# Altium schematic sheet StreamDeck_CPU2-V0.SchDoc: Microcontrolador/UART - Stream Deck
size A4; Author: Guido Glorioso; Revision: 0; SheetNumber: 4; SheetTotal: 5
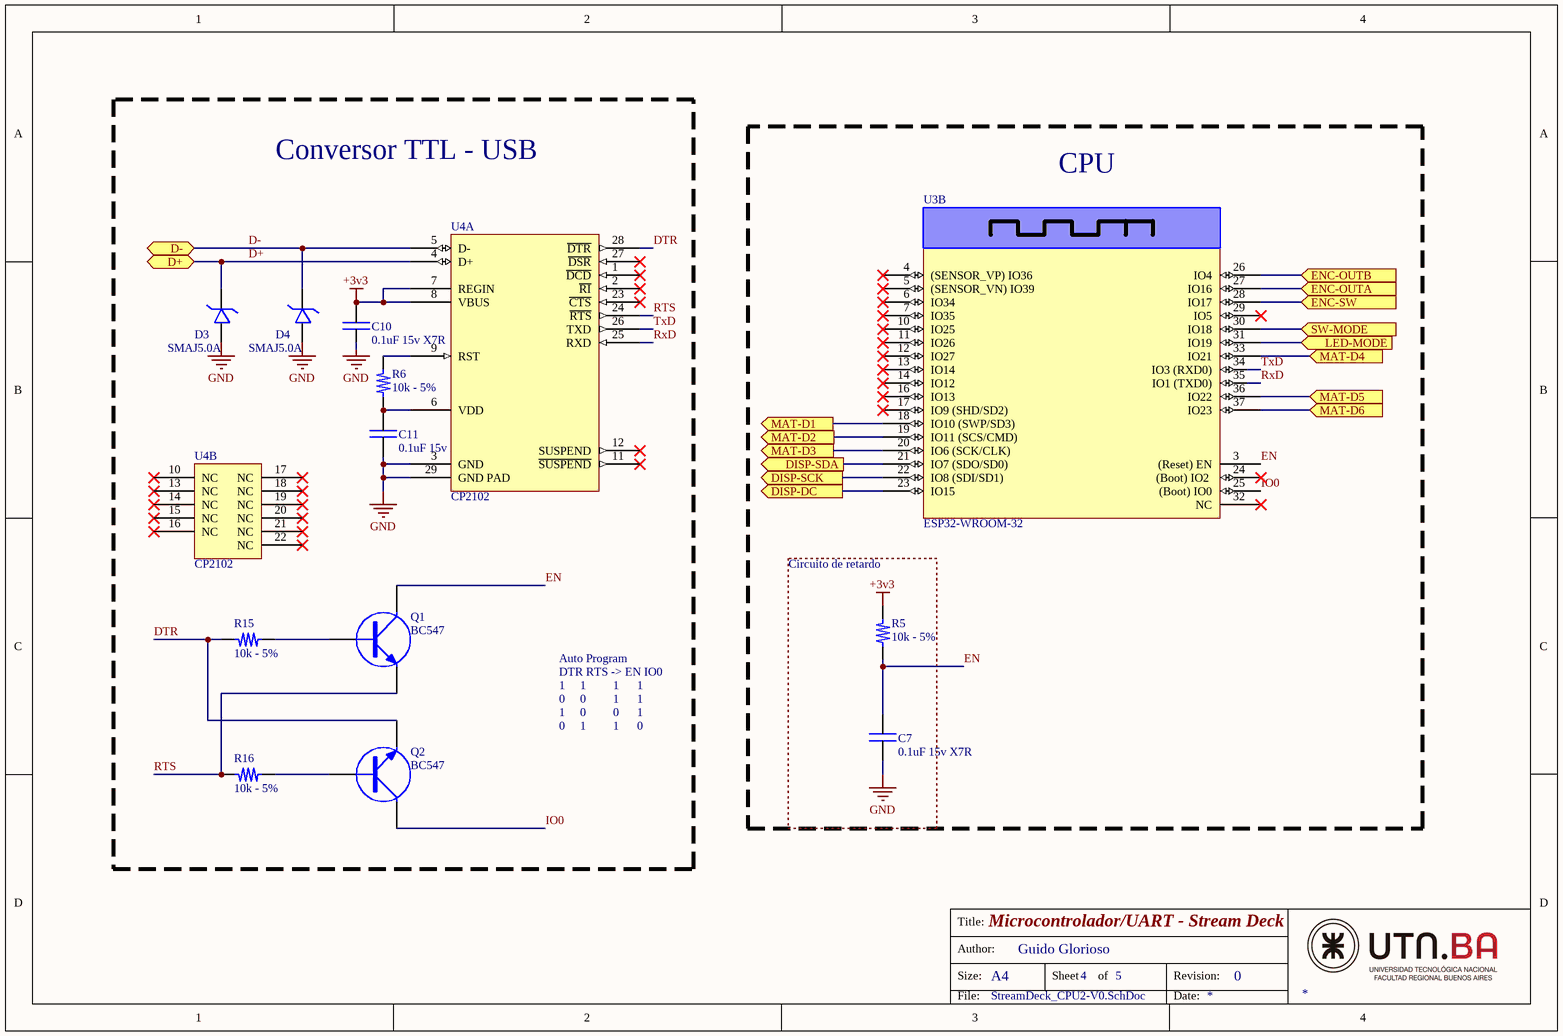
[diagram p0: StreamDeck_CPU2-V0.SchDoc]

## Parts
C7  0.1uF 15v X7R  [C_0805]
C10  0.1uF 15v X7R  [C_0805]
C11  0.1uF 15v X7R  [C_0805]
D3  SMAJ5.0A  [D_SMA]
D4  SMAJ5.0A  [D_SMA]
Q1  BC547  [SOT_23]
Q2  BC547  [SOT_23]
R5  10k - 5%  [R_0805]
R6  10k - 5%  [R_0805]
R15  10k - 5%  [R_0805]
R16  10k - 5%  [R_0805]
U3  ESP32-WROOM-32  [Espressif ESP32-WROOM-32]  (part B of 2)
U4  CP2102  [QFN-28N]  (parts A,B of 2)

## Blocks framed on the sheet
Conversor TTL - USB: C10 C11 D3 D4 Q1 Q2 R6 R15 R16 U4
CPU: U3
Circuito de retardo: C7 R5

## Ports
D+ (bidir, see StreamDeck_BLK-V0[2B], StreamDeck_alimentacion-V0[2C]), D- (bidir, see StreamDeck_BLK-V0[2B], StreamDeck_alimentacion-V0[2D]), DISP-DC (out, see StreamDeck_BLK-V0[2B], StreamDeck_Perifericos-V0[3C]), DISP-SCK (out, see StreamDeck_BLK-V0[2B], StreamDeck_Perifericos-V0[3C]), DISP-SDA (out, see StreamDeck_BLK-V0[2B], StreamDeck_Perifericos-V0[3C]), ENC-OUTA (in, see StreamDeck_BLK-V0[2B], StreamDeck_Perifericos-V0[3A]), ENC-OUTB (in, see StreamDeck_BLK-V0[2B], StreamDeck_Perifericos-V0[3A]), ENC-SW (in, see StreamDeck_BLK-V0[2C], StreamDeck_Perifericos-V0[4A]), LED-MODE (in, see StreamDeck_BLK-V0[2C], StreamDeck_Perifericos-V0[4C]), MAT-D1 (out, see StreamDeck_BLK-V0[2B], StreamDeck_Perifericos-V0[1A]), MAT-D2 (out, see StreamDeck_BLK-V0[2B], StreamDeck_Perifericos-V0[2A]), MAT-D3 (out, see StreamDeck_BLK-V0[2B], StreamDeck_Perifericos-V0[2A]), MAT-D4 (in, see StreamDeck_BLK-V0[2B], StreamDeck_Perifericos-V0[3A]), MAT-D5 (in, see StreamDeck_BLK-V0[2B], StreamDeck_Perifericos-V0[3B]), MAT-D6 (in, see StreamDeck_BLK-V0[2B], StreamDeck_Perifericos-V0[3B]), SW-MODE (in, see StreamDeck_BLK-V0[2C], StreamDeck_Perifericos-V0[4C])

## Nets
+3v3: C10.1 R5.2 U4.7(REGIN) U4.8(VBUS)
GND: C7.2 C10.2 C11.2 D3.1(anodo) D4.1(anodo) U4.3(GND) U4.29(GND_PAD)
D+: D3.2(catodo) U4.4(D+) ; port D+
D-: D4.2(catodo) U4.5(D-) ; port D-
DISP-DC: U3.23(IO15) ; port DISP-DC
DISP-SCK: U3.22(IO8_(SDI/SD1)) ; port DISP-SCK
DISP-SDA: U3.21(IO7_(SDO/SD0)) ; port DISP-SDA
DTR: Q2.3(E) R15.2 U4.28(~{DTR})
EN: C7.1 Q1.2(C) R5.1 U3.3((Reset)_EN)
ENC-OUTA: U3.27(IO16) ; port ENC-OUTA
ENC-OUTB: U3.26(IO4) ; port ENC-OUTB
ENC-SW: U3.28(IO17) ; port ENC-SW
IO0: Q2.2(C) U3.25((Boot)_IO0)
LED-MODE: U3.31(IO19) ; port LED-MODE
MAT-D1: U3.18(IO10_(SWP/SD3)) ; port MAT-D1
MAT-D2: U3.19(IO11_(SCS/CMD)) ; port MAT-D2
MAT-D3: U3.20(IO6_(SCK/CLK)) ; port MAT-D3
MAT-D4: U3.33(IO21) ; port MAT-D4
MAT-D5: U3.36(IO22) ; port MAT-D5
MAT-D6: U3.37(IO23) ; port MAT-D6
RTS: Q1.3(E) R16.2 U4.24(~{RTS})
RxD: U3.35(IO1_(TXD0)) U4.25(RXD)
SW-MODE: U3.30(IO18) ; port SW-MODE
TxD: U3.34(IO3_(RXD0)) U4.26(TXD)
NetC11_1: C11.1 R6.1 U4.6(VDD)
NetQ1_1: Q1.1(B) R15.1
NetQ2_1: Q2.1(B) R16.1
NetR6_2: R6.2 U4.9(RST)

Not connected (* = marked no-connect by the designer): U3 4((SENSOR_VP)_IO36)* 5((SENSOR_VN)_IO39)* 6(IO34)* 7(IO35)* 10(IO25)* 11(IO26)* 12(IO27)* 13(IO14)* 14(IO12)* 16(IO13)* 17(IO9_(SHD/SD2))* 24((Boot)_IO2_)* 29(IO5)* 32(NC)*; U4 1(~{DCD})* 2(~{RI})* 10(NC)* 11(~{SUSPEND})* 12(SUSPEND)* 13(NC)* 14(NC)* 15(NC)* 16(NC)* 17(NC)* 18(NC)* 19(NC)* 20(NC)* 21(NC)* 22(NC)* 23(~{CTS})* 27(~{DSR})*

## Notes on the sheet
- Auto Program
- DTR RTS -> EN IO0
- 1     1         1      1
- 0     0         1      1
- 1     0         0      1
- 0     1         1      0
- Title:
- Size:
- Author:
- A4
- Sheet
- of
- Revision:
- File:
- Date:

## Library data of the parts
C7 C10 C11 = Capacitor NP: Capacitor no polarizado
D3 D4 = Diodo TVS
Q1 Q2 = Transistor NPN: Transistor bipolar NPN - Encapsulado SOT-23
R5 R6 R15 R16 = Resistor
U3 = ESP32: Modulo Bluetooth/Wifi/Microcontrolador ESP32-WROOM-32 de EspressIf. 38 pines, SMD, con antena incluida.
U4 = CP2102: SINGLE-CHIP USB TO UART BRIDGE WITH BUILT IN 3V3 REGULATOR